# EAGLE design schema (EAGLE 6.5.0)
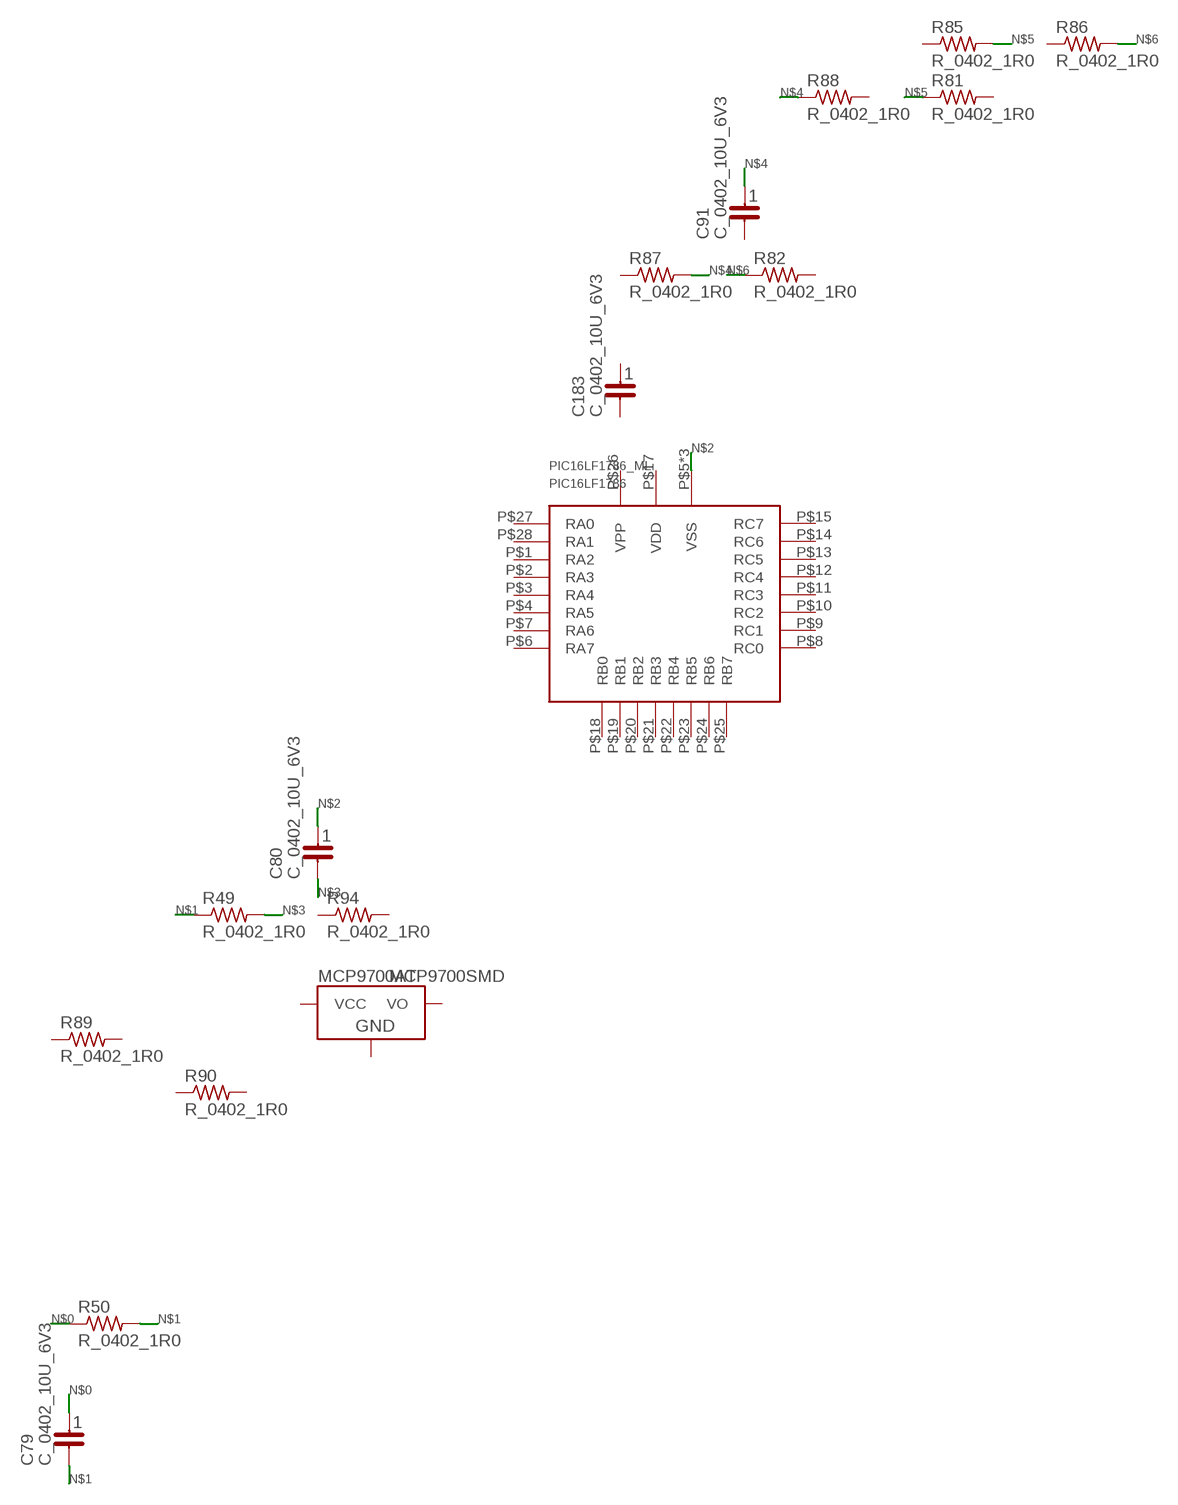
[diagram p0: schematic, sheet 1]

## Parts
C79  C_0402_10U_6V3  [C_0402]
C80  C_0402_10U_6V3  [C_0402]
C91  C_0402_10U_6V3  [C_0402]
C183  C_0402_10U_6V3  [C_0402]
MCP9700AT  MCP9700SMD  [SOT23-3]
PIC16LF1786_ML  PIC16LF1786  [28-QFN]
R49  R_0402_1R0  [R_0402]
R50  R_0402_1R0  [R_0402]
R81  R_0402_1R0  [R_0402]
R82  R_0402_1R0  [R_0402]
R85  R_0402_1R0  [R_0402]
R86  R_0402_1R0  [R_0402]
R87  R_0402_1R0  [R_0402]
R88  R_0402_1R0  [R_0402]
R89  R_0402_1R0  [R_0402]
R90  R_0402_1R0  [R_0402]
R94  R_0402_1R0  [R_0402]

## Nets
N$0: C79.1 R50.P$1
N$1: C79.2 R49.P$1 R50.P$2
N$2: C80.1 PIC16LF1786_ML.P$5(VSS) PIC16LF1786_ML.P$16(VSS) PIC16LF1786_ML.PAD(VSS)
N$3: C80.2 R49.P$2
N$4: C91.1 R87.P$2 R88.P$1
N$5: R81.P$1 R85.P$2
N$6: R82.P$1 R86.P$2
Unconnected: C91.2 C183.1 C183.2 MCP9700AT.1(VCC) MCP9700AT.2(VO) MCP9700AT.3(GND) PIC16LF1786_ML.P$1(RA2) PIC16LF1786_ML.P$2(RA3) PIC16LF1786_ML.P$3(RA4) PIC16LF1786_ML.P$4(RA5) PIC16LF1786_ML.P$6(RA7) PIC16LF1786_ML.P$7(RA6) PIC16LF1786_ML.P$8(RC0) PIC16LF1786_ML.P$9(RC1) PIC16LF1786_ML.P$10(RC2) PIC16LF1786_ML.P$11(RC3) PIC16LF1786_ML.P$12(RC4) PIC16LF1786_ML.P$13(RC5) PIC16LF1786_ML.P$14(RC6) PIC16LF1786_ML.P$15(RC7) PIC16LF1786_ML.P$17(VDD) PIC16LF1786_ML.P$18(RB0) PIC16LF1786_ML.P$19(RB1) PIC16LF1786_ML.P$20(RB2) PIC16LF1786_ML.P$21(RB3) PIC16LF1786_ML.P$22(RB4) PIC16LF1786_ML.P$23(RB5) PIC16LF1786_ML.P$24(RB6) PIC16LF1786_ML.P$25(RB7) PIC16LF1786_ML.P$26(VPP) PIC16LF1786_ML.P$27(RA0) PIC16LF1786_ML.P$28(RA1) R81.P$2 R82.P$2 R85.P$1 R86.P$1 R87.P$1 R88.P$2 R89.P$1 R89.P$2 R90.P$1 R90.P$2 R94.P$1 R94.P$2

## Library data of the parts
C79 C80 C91 C183 = juneSpreadsheetParts:C_0402_10U_6V3
MCP9700AT = ecad:MCP9700; PROD_ID: IC-08917
PIC16LF1786_ML = Batch_2:PIC16LF1786
R49 R50 R81 R82 R85-R90 R94 = juneSpreadsheetParts:R_0402_1R0

## Board
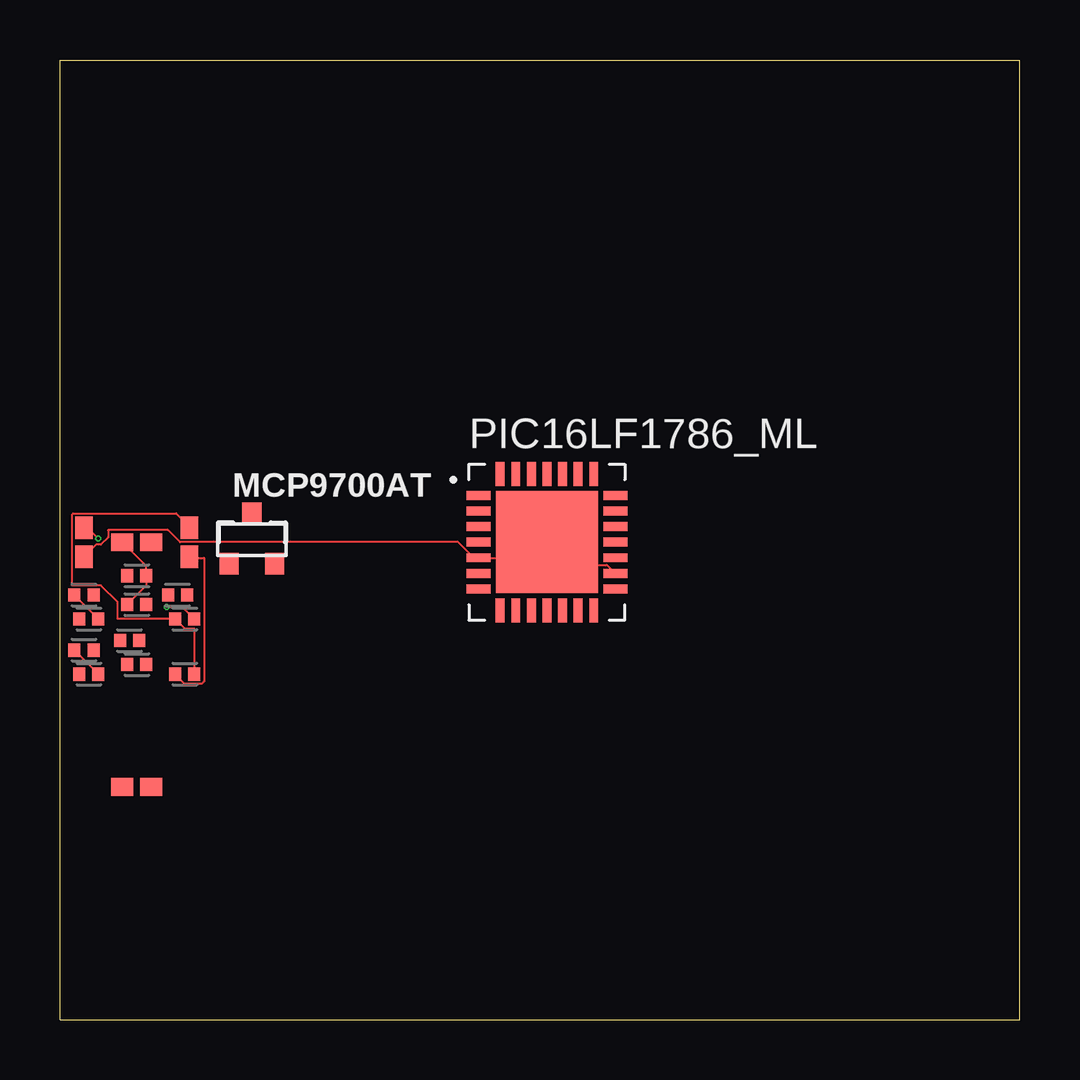
[diagram p1: board, top side]
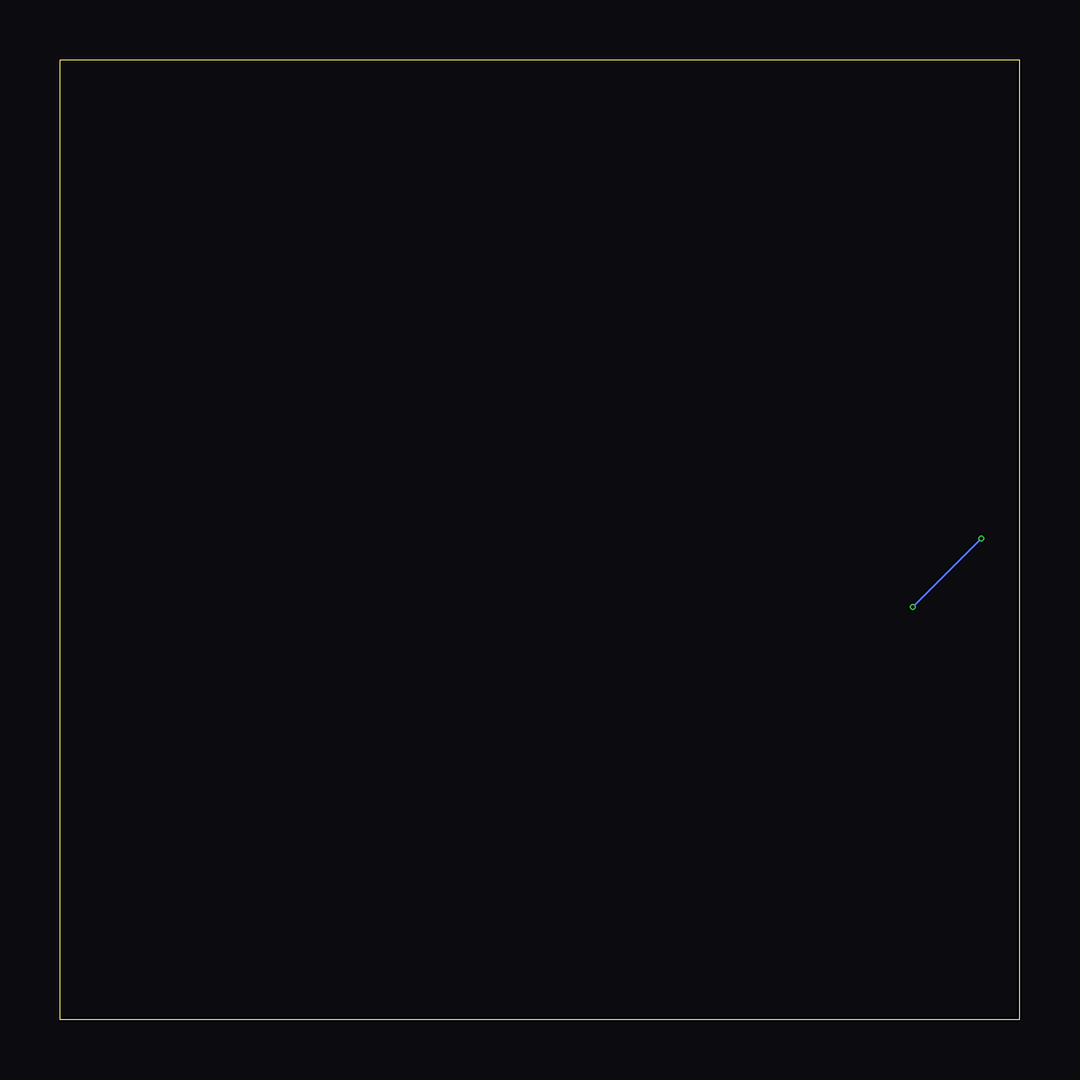
[diagram p2: board, bottom side, seen from below]

Size 40 x 40 mm. Coordinates in mm from the lower left corner, seen from the top.
Outline: 0,0 40,0 40,40 0,40 0,0
Copper layers (1*16): Top 0.035mm / dielectric 0.75mm / Bottom 0.035mm
Design rules "default": minimum track width 3mil, minimum drill 5mil, track to track 3mil, track to pad 3mil, pad to pad 3mil, via to via 3mil, smd to smd 0mil, copper to edge 5mil, drill to drill 8mil, minimum pad ring 5mil, minimum via ring 2.5mil, stop-mask expansion 4mil, vias tented up to drill 0mil, thermal gap 10mil

### Footprints (pad centres in the part's own frame; a part is rotated, then mirrored left to right if it is on the bottom)
C_0402 = smd 0.93 x 0.74: 1 -0.605,0; 2 0.605,0
SOT23-3 = smd 0.8 x 0.9: 1 -0.95,-1; 2 0.95,-1; 3 0,1.1
28-QFN = smd 1 x 0.37: P$1 -2.85,1.95; P$2 -2.85,1.3; P$3 -2.85,0.65; P$4 -2.85,0; P$5 -2.85,-0.65; P$6 -2.85,-1.3; P$7 -2.85,-1.95; P$15 2.85,-1.95; P$16 2.85,-1.3; P$17 2.85,-0.65; P$18 2.85,0; P$19 2.85,0.65; P$20 2.85,1.3; P$21 2.85,1.95 | smd 0.37 x 1: P$8 -1.95,-2.85; P$9 -1.3,-2.85; P$10 -0.65,-2.85; P$11 0,-2.85; P$12 0.65,-2.85; P$13 1.3,-2.85; P$14 1.95,-2.85; P$22 1.95,2.85; P$23 1.3,2.85; P$24 0.65,2.85; P$25 0,2.85; P$26 -0.65,2.85; P$27 -1.3,2.85; P$28 -1.95,2.85 | smd 4.25 x 4.25: PAD 0,0
R_0402 = smd 0.5 x 0.55: P$1 -0.4,0; P$2 0.4,0

### Placement (x,y rotation side)
C79  5.4,19.9 90 top
C80  1,19.9 90 top
C91  3.2,19.9 0 top
C183  3.2,9.7 0 top
MCP9700AT  8,20 0 top
PIC16LF1786_ML  20.3,19.9 0 top
R49  5.2,16.7 0 top
R50  5.2,14.4 0 top
R81  1,17.7 0 top
R82  1,15.4 0 top
R85  1.2,16.7 0 top
R86  1.2,14.4 0 top
R87  3.2,18.5 0 top
R88  3.2,17.3 0 top
R89  2.9,15.8 0 top
R90  4.9,17.7 0 top
R94  3.2,14.8 0 top

### Tracks (layer width: path | path; a pad name or v marks a point on that pad's centre or on a via)
N$0
  Top 0.076: R50.P$1 5.2,14 5.9,14 6,14.1 6,19.25 5.4,19.25 C79.1
N$1
  Top 0.076: R50.P$2 5.6,16.3 5.2,16.3 R49.P$1 2.4,16.7 2.4,17.4 1.7,18.1 0.5,18.1 0.5,21.05 0.55,21.1 4.85,21.1 5.4,20.55 C79.2
N$2
  Top 0.076: PIC16LF1786_ML.P$16 22.8,18.95 21.25,18.95 PIC16LF1786_ML.PAD 20.3,19.85 19.7,19.25 PIC16LF1786_ML.P$5 17.25,19.25 16.6,19.9 5,19.9 4.5,20.4 2,20.4 2,20.1 1.7,19.8 1.5,19.8 C80.1
N$3  (via drill 0.13)
  Top 0.076: R49.P$2 5.1,17.2 v4.45,17.2 | v1.6,20.05 1.15,20.5 C80.2
  Bottom 0.076: v1.6,20.05 v4.45,17.2
N$4
  Top 0.076: R88.P$1 3.6,18.1 R87.P$2 3.6,18.9 C91.1
N$5
  Top 0.076: R81.P$1 R85.P$2
N$6
  Top 0.076: R82.P$1 R86.P$2